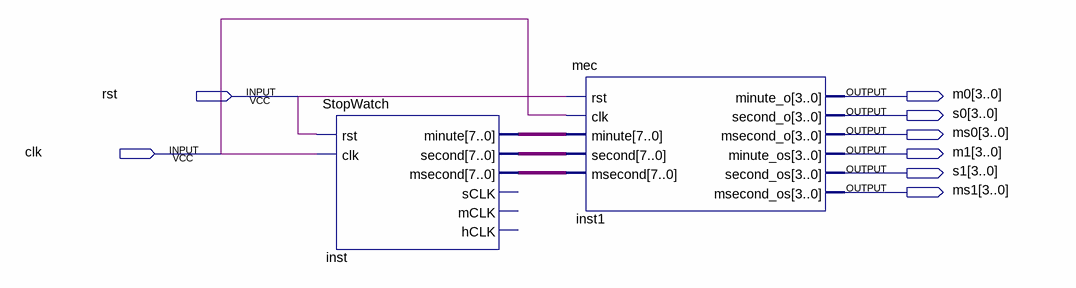
[diagram p0: schematic sheet]
// Quartus schematic mss.bdf as structural Verilog: 2 symbols, 8 pins
module mss (
  input  rst,
  input  clk,
  output [3:0] m0,
  output [3:0] s0,
  output [3:0] ms0,
  output [3:0] m1,
  output [3:0] s1,
  output [3:0] ms1
);

  wire [7:0] inst_minute, inst_msecond, inst_second;

  StopWatch inst (
    .rst(rst), .clk(clk), .minute(inst_minute), .second(inst_second), .msecond(inst_msecond));  // open: sCLK, mCLK, hCLK
  mec inst1 (
    .rst(rst), .clk(clk), .minute(inst_minute), .second(inst_second), .msecond(inst_msecond), .minute_o(m0),
    .second_o(s0), .msecond_o(ms0), .minute_os(m1), .second_os(s1), .msecond_os(ms1));
endmodule
